# Altium schematic sheet WireLessPhone_Photodiod.SchDoc
size 420 x 297 mm; DocumentNumber: ФНКЦ.542321.001 Э3; SheetNumber: 4; Format: A3
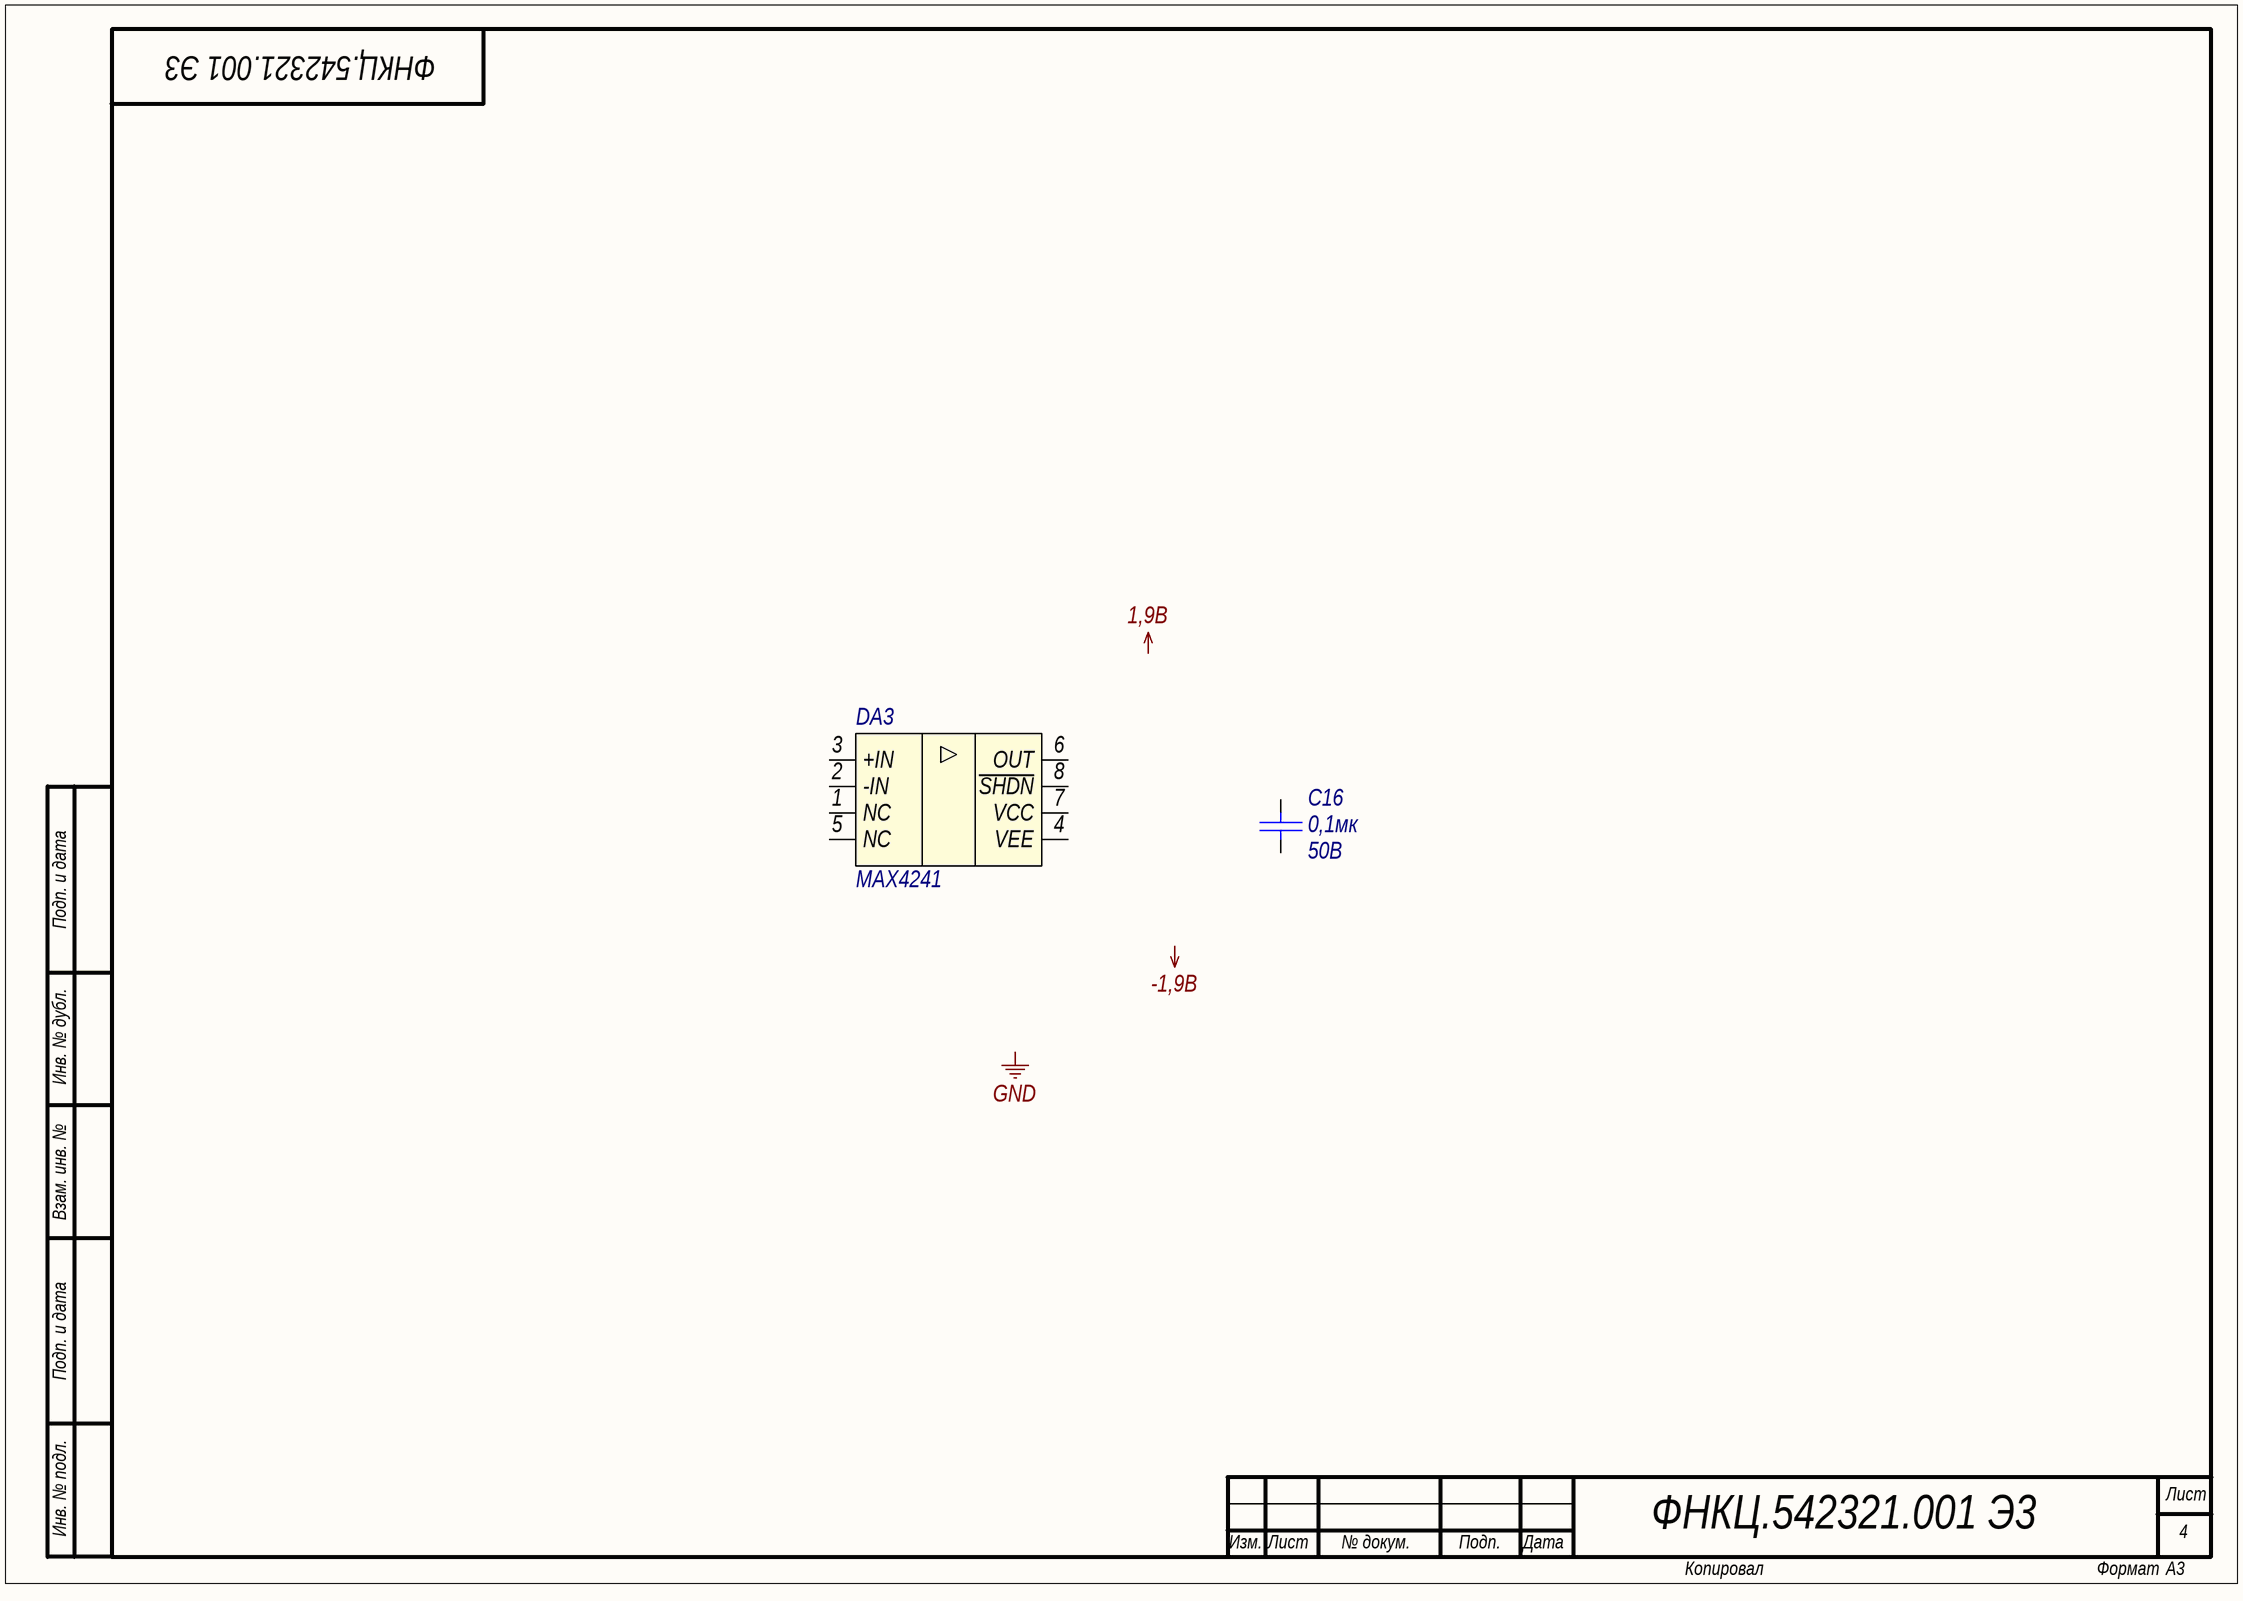
[diagram p0: WireLessPhone_Photodiod.SchDoc]

## Parts
C16  value 0,1мк  Voltage: 50B  [C0603]  (hidden comment: Capacitor)
DA3  MAX4241  [8µMAX]

## Nets

Not connected (* = marked no-connect by the designer): C16 1 2; DA3 1(NC) 2(-IN) 3(+IN) 4(VEE) 5(NC) 6(OUT) 7(VCC) 8(~{SHDN})

## Notes on the sheet
- Подп. и дата
- Инв. № дубл.
- Взам. инв. №
- Инв. № подл.
- Лист
- Изм.
- № докум.
- Подп.
- Дата
- Копировал
- Формат
- Labels drawn without touching a wire or pin: 1,9В, -1,9В, GND

## Library data of the parts
C16 = cap131: Конденсатор; Part Name: Ceramic; Manufacture: Murata; Part Number: GRM188R71H104K; id: cap131; TKE: X7R
DA3 = amp9: МИКРОМОЩНЫЙ Single/Dual/Quad, +1.8V/10µA, SOT23,  Beyond-the-Rails Op Amps; Part Name: Micropower / Operational Amplifiers; Part Number: MAX4241EUA; Manufacture: Maxim Integrated; id: amp9; Rail-to-rail: yes; Supply Voltage: 1,8V–5,5V or (+-)0,9В-(+-)2,75B; Supply Current max: 10uA; Bandwidth: 90kHz; Input Bias Current: (+-)2,3nA; CMRR: 90dB; PSRR: 85dB; Offset voltage: (+-)0,2mB; Channels: 1